# EAGLE design Airhockeypuck (EAGLE 9.5.1)
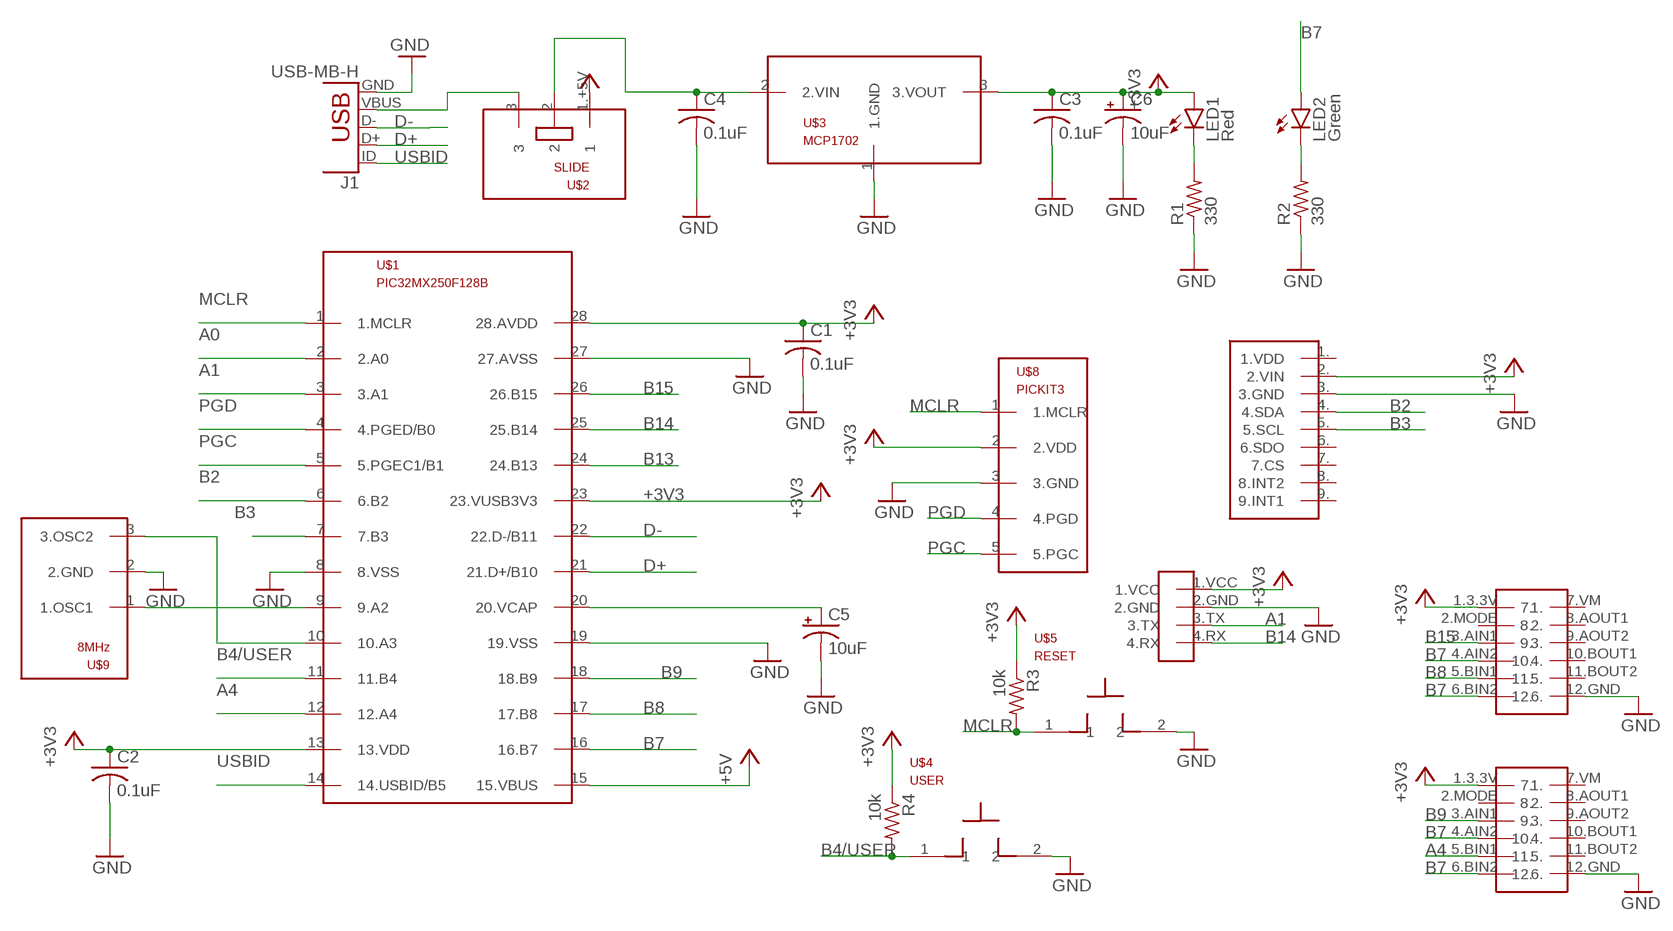
[diagram p0: schematic, sheet 1]

## Parts
C1  0.1uF  C-US025-025X050  [C025-025X050]
C2  0.1uF  C-US025-025X050  [C025-025X050]
C3  0.1uF  C-US025-025X050  [C025-025X050]
C4  0.1uF  C-US025-025X050  [C025-025X050]
C5  10uF  CPOL-USB45181B  [B45181B]
C6  10uF  CPOL-USB45181B  [B45181B]
J1  USB-MB-H  [USB-MB-H]
LED1  Red  LED3MM  [LED3MM]
LED2  Green  LED3MM  [LED3MM]
R1  330  R-US_0207/10  [0207/10]
R2  330  R-US_0207/10  [0207/10]
R3  10k  R-US_0207/10  [0207/10]
R4  10k  R-US_0207/10  [0207/10]
U$1  PIC32MX250F128B  [DIL28-3]
U$2  SLIDE  [SLIDE]
U$3  MCP1702  [TO92]
U$4  USER  PB  [PB]
U$5  RESET  PB  [PB]
U$6  DRV8835  [DRV8835]
U$7  DRV8835  [DRV8835]
U$8  PICKIT3  [1X05]
U$9  8MHz  OSC  [OSC]
U$10  IMU  [IMU]
U$11  HC-08  [HC-08]

## Nets
+3V3: C1.1 C2.1 C3.1 C6.+ LED1.A R3.1 R4.1 U$1.13(13.VDD) U$1.23(23.VUSB3V3) U$1.28(28.AVDD) U$3.3(3.VOUT) U$6.1.3.3V(1.) U$7.1.3.3V(1.) U$8.2(2.VDD) U$10.2.(2.VIN)
+5V: U$1.15(15.VBUS) U$2.1.+5V
A0: U$1.2(2.A0)
A1: U$1.3(3.A1) U$11.3.TX
A4: U$1.12(12.A4) U$7.5.BIN1(5.)
B2: U$1.6(6.B2) U$10.4.(4.SDA)
B3: U$1.7(7.B3) U$10.5.(5.SCL)
B4/USER: R4.2 U$1.11(11.B4) U$4.1
B7: LED2.A U$1.16(16.B7) U$6.4.AIN2(4.) U$6.6.BIN2(6.) U$7.4.AIN2(4.) U$7.6.BIN2(6.)
B8: U$1.17(17.B8) U$6.5.BIN1(5.)
B9: U$1.18(18.B9) U$7.3.AIN1(3.)
B13: U$1.24(24.B13)
B14: U$1.25(25.B14) U$11.4.RX
B15: U$1.26(26.B15) U$6.3.AIN1(3.)
D+: J1.D+ U$1.21(21.D+/B10)
D-: J1.D- U$1.22(22.D-/B11)
GND: C1.2 C2.2 C3.2 C4.2 C5.- C6.- J1.GND R1.1 R2.1 U$1.8(8.VSS) U$1.19(19.VSS) U$1.27(27.AVSS) U$3.1(1.GND) U$4.2 U$5.2 U$6.12.GND(12.) U$7.12.GND(12.) U$8.3(3.GND) U$9.2(2.GND) U$10.3.(3.GND) U$11.2.GND
MCLR: R3.2 U$1.1(1.MCLR) U$5.1 U$8.1(1.MCLR)
N$1: J1.VBUS U$2.3
N$2: U$1.9(9.A2) U$9.1(1.OSC1)
N$3: U$11.1.VCC ; supply symbol labelled +3V3
N$4: LED2.K(C) R2.2
N$5: LED1.K(C) R1.2
N$6: U$1.10(10.A3) U$9.3(3.OSC2)
N$7: C5.+ U$1.20(20.VCAP)
N$8: C4.1 U$2.2 U$3.2(2.VIN)
PGC: U$1.5(5.PGEC1/B1) U$8.5(5.PGC)
PGD: U$1.4(4.PGED/B0) U$8.4(4.PGD)
USBID: J1.ID U$1.14(14.USBID/B5)
Unconnected: U$6.2.MODE(2.) U$6.7.VM(7.) U$6.8.AOUT1(8.) U$6.9.AOUT2(9.) U$6.10.BOUT1(10.) U$6.11.BOUT2(11.) U$7.2.MODE(2.) U$7.7.VM(7.) U$7.8.AOUT1(8.) U$7.9.AOUT2(9.) U$7.10.BOUT1(10.) U$7.11.BOUT2(11.) U$10.1.(1.VDD) U$10.6.(6.SDO) U$10.7.(7.CS) U$10.8.(8.INT2) U$10.9.(9.INT1)

## Library data of the parts
C1-C4 = MEE_433:C-US: CAPACITOR, American symbol; SPICEPREFIX: C
C5 C6 = MEE_433:CPOL-US: POLARIZED CAPACITOR, American symbol; SPICEPREFIX: C
J1 = MEE_433:USB: USB Connectors USB-B-PTH is fully proven SKU : PRT-00139/CONN-08278 USB-miniB is fully proven SKU : PRT-00587 USB-A-PCB is untested. USB-A-H is throughly reviewed, but untested. Spark Fun Electronics SKU : PRT-00437 USB-B-SMT is throughly reviewed, but untested. Needs silkscreen touching up. USB-A-S has not been used/tested USB-MB-H has not been used/tested USB-MICROB has been used. CONN-09505
LED1 LED2 = led:LED: LED OSRAM: - CHIPLED LG R971, LG N971, LY N971, LG Q971, LY Q971, LO R971, LY R971 LH N974, LH R974 LS Q976, LO Q976, LY Q976 LO Q996 - Hyper CHIPLED LW Q18S LB Q993, LB Q99A, LB R99A - SideLED LS A670, LO A670, LY A670, LG A670, LP A670 LB A673, LV A673, LT A673, LW A673 LH A674 LY A675 LS A676, LA A676, LO A676, LY A676, LW A676 LS A679, LY A679, LG A679 - Hyper Micro SIDELED® LS Y876, LA Y876, LO Y876, LY Y876 LT Y87S - SmartLED LW L88C, LW L88S LB L89C, LB L89S, LG L890 LS L89K, LO L89K, LY L89K LS L896, LA L896, LO L896, LY L896 - TOPLED LS T670, LO T670, LY T670, LG T670, LP T670 LSG T670, LSP T670, LSY T670, LOP T670, LYG T670 LG T671, LOG T671, LSG T671 LB T673, LV T673, LT T673, LW T673 LH T674 LS T676, LA T676, LO T676, LY T676, LB T676, LH T676, LSB T676, LW T676 LB T67C, LV T67C, LT T67C, LS T67K, LO T67K, LY T67K, LW E67C LS E67B, LA E67B, LO E67B, LY E67B, LB E67C, LV E67C, LT E67C LW T67C LS T679, LY T679, LG T679 LS T770, LO T770, LY T770, LG T770, LP T770 LB T773, LV T773, LT T773, LW T773 LH T774 LS E675, LA E675, LY E675, LS T675 LS T776, LA T776, LO T776, LY T776, LB T776 LHGB T686 LT T68C, LB T68C - Hyper Mini TOPLED® LB M676 - Mini TOPLED Santana® LG M470 LS M47K, LO M47K, LY M47K Source: http://www.osram.convergy.de LUXEON: - LUMILED® LXK2-PW12-R00, LXK2-PW12-S00, LXK2-PW14-U00, LXK2-PW14-V00 LXK2-PM12-R00, LXK2-PM12-S00, LXK2-PM14-U00 LXK2-PE12-Q00, LXK2-PE12-R00, LXK2-PE12-S00, LXK2-PE14-T00, LXK2-PE14-U00 LXK2-PB12-K00, LXK2-PB12-L00, LXK2-PB12-M00, LXK2-PB14-N00, LXK2-PB14-P00, LXK2-PB14-Q00 LXK2-PR12-L00, LXK2-PR12-M00, LXK2-PR14-Q00, LXK2-PR14-R00 LXK2-PD12-Q00, LXK2-PD12-R00, LXK2-PD12-S00 LXK2-PH12-R00, LXK2-PH12-S00 LXK2-PL12-P00, LXK2-PL12-Q00, LXK2-PL12-R00 Source: www.luxeon.com KINGBRIGHT: KA-3528ASYC Source: www.kingbright.com
R1-R4 = MEE_433:R-US_: RESISTOR, American symbol; SPICEPREFIX: R
U$1 = MEE_433:PIC32MX250F128B
U$2 = MEE_433:SLIDE
U$3 = MEE_433:MCP1702
U$4 U$5 = MEE_433:PB
U$6 U$7 = MEE_433:DRV8835
U$8 = MEE_433:PICKIT3
U$9 = MEE_433:OSC
U$10 = MEE_433:IMU
U$11 = MEE_433:HC-08

## Board
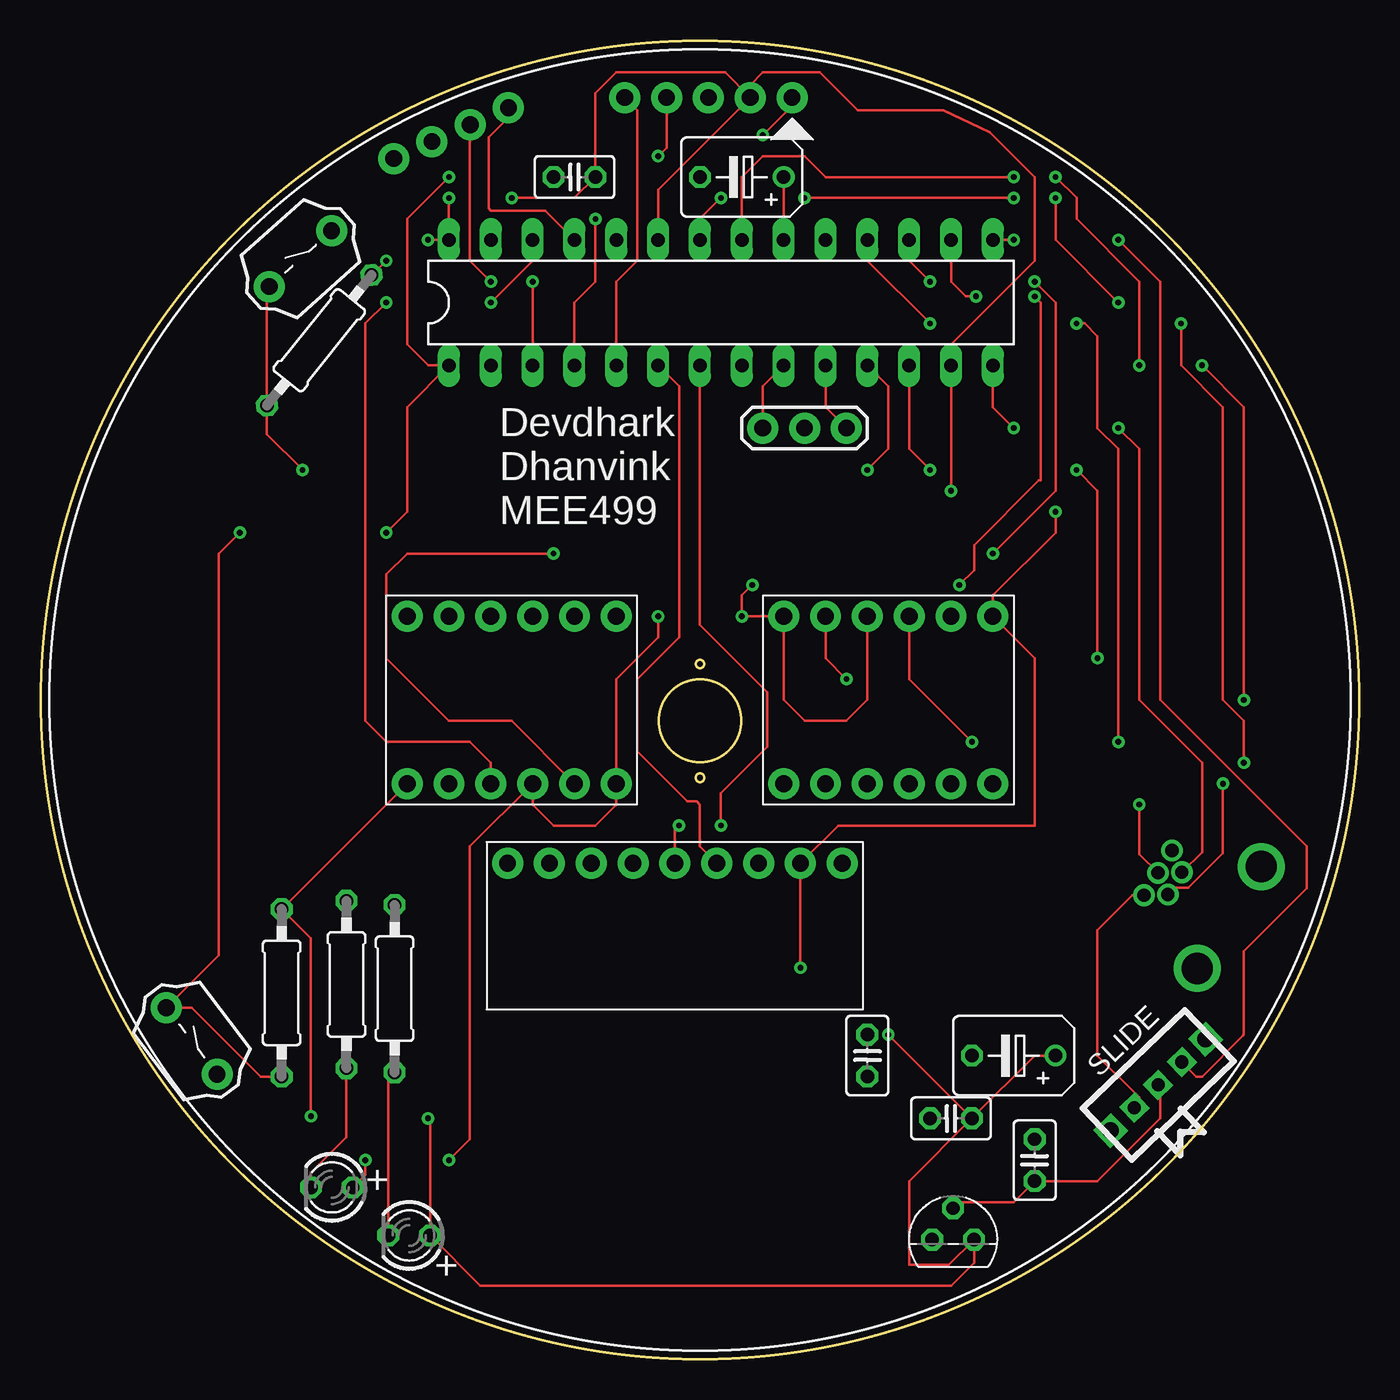
[diagram p1: board, top side]
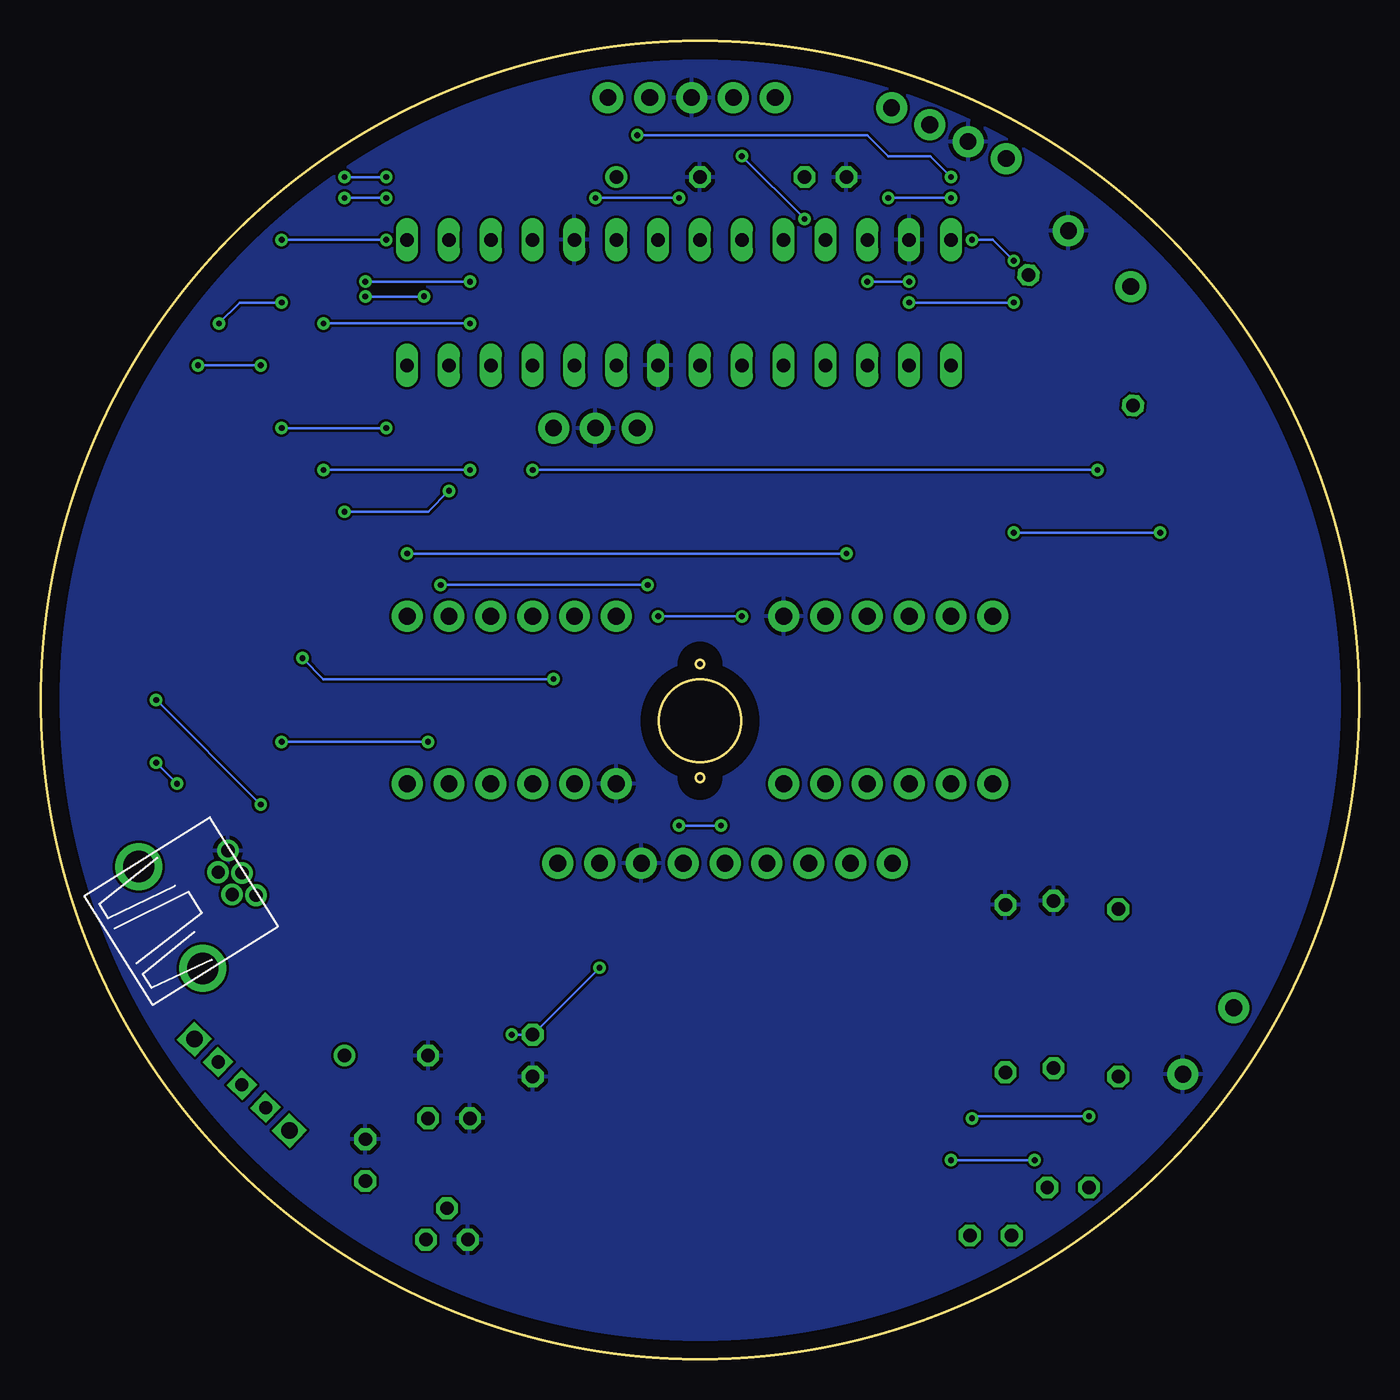
[diagram p2: board, bottom side, seen from below]

Size 80 x 80 mm. Coordinates in mm from the lower left corner, seen from the top.
Outline: circle at 40,40 radius 40
Outline: circle at 40,38.73 radius 2.5
Outline: circle at 40,42.18 radius 0.25
Outline: circle at 40,35.28 radius 0.25
Copper layers (1*16): Top 0.035mm / dielectric 1.5mm / Bottom 0.035mm
Design rules "default": minimum track width 6mil, minimum drill 0.35mm, track to track 6mil, track to pad 6mil, pad to pad 6mil, via to via 6mil, smd to smd 6mil, copper to edge 40mil, drill to drill 6mil, minimum pad ring 10mil, minimum via ring 8mil, stop-mask expansion 4mil, vias tented up to drill 0mil, thermal gap 10mil

### Footprints (pad centres in the part's own frame; a part is rotated, then mirrored left to right if it is on the bottom)
C025-025X050 = drill 0.813 octagon: 1 -1.27,0; 2 1.27,0
B45181B = drill 0.813: + -2.54,0 | drill 0.813 octagon: - 2.54,0
USB-MB-H = drill 0.8: D+ 5.1,0; D- 3.9,0.8; GND 5.1,-1.6; ID 3.9,-0.8; VBUS 5.1,1.6 | drill 1.9: P$6 0,-3.65; P$7 0,3.65
LED3MM = drill 0.813 octagon: A -1.27,0; K 1.27,0
0207/10 = drill 0.813 octagon: 1 -5.08,0; 2 5.08,0
DIL28-3 = drill 0.813 long: 1 -16.51,-3.81; 2 -13.97,-3.81; 3 -11.43,-3.81; 4 -8.89,-3.81; 5 -6.35,-3.81; 6 -3.81,-3.81; 7 -1.27,-3.81; 8 1.27,-3.81; 9 3.81,-3.81; 10 6.35,-3.81; 11 8.89,-3.81; 12 11.43,-3.81; 13 13.97,-3.81; 14 16.51,-3.81; 15 16.51,3.81; 16 13.97,3.81; 17 11.43,3.81; 18 8.89,3.81; 19 6.35,3.81; 20 3.81,3.81; 21 1.27,3.81; 22 -1.27,3.81; 23 -3.81,3.81; 24 -6.35,3.81; 25 -8.89,3.81; 26 -11.43,3.81; 27 -13.97,3.81; 28 -16.51,3.81
SLIDE = drill 0.8 square: 1.+5V -2,0; 2 0,0; 3 2,0 | drill 1 square: P$1 -4,0; P$2 4,0
TO92 = drill 0.813 octagon: 1 -1.27,0; 2 0,1.905; 3 1.27,0
PB = drill 1.016 pad 1.88: 1 -2.54,0; 2 2.54,0
DRV8835 = drill 1.016 pad 1.88: 1.3.3V -5.08,5.08; 2.MODE -5.08,2.54; 3.AIN1 -5.08,0; 4.AIN2 -5.08,-2.54; 5.BIN1 -5.08,-5.08; 6.BIN2 -5.08,-7.62; 7.VM 5.08,5.08; 8.AOUT1 5.08,2.54; 9.AOUT2 5.08,0; 10.BOUT1 5.08,-2.54; 11.BOUT2 5.08,-5.08; 12.GND 5.08,-7.62
1X05 = drill 1.016 pad 1.88: 1 0,0; 2 2.54,0; 3 5.08,0; 4 7.62,0; 5 10.16,0
OSC = drill 1.016 pad 1.88: 1 -2.54,0; 2 0,0; 3 2.54,0
IMU = drill 1.016 pad 1.88: 1. 0,0; 2. 2.54,0; 3. 5.08,0; 4. 7.62,0; 5. 10.16,0; 6. 12.7,0; 7. 15.24,0; 8. 17.78,0; 9. 20.32,0
HC-08 = drill 1.016 pad 1.88: 1.VCC 0,3.81; 2.GND 0,1.27; 3.TX 0,-1.27; 4.RX 0,-3.81

### Placement (x,y rotation side)
C1  55.24,14.6 180 top
C2  50.16,18.41 270 top
C3  32.38,71.75 180 top
C4  60.32,12.06 90 top
C5  42.54,71.75 180 top
C6  59.05,18.41 180 top
J1  72.13,26.79 147.9 top
LED1  22.35,7.49 180 top
LED2  17.65,10.41 180 top
R1  21.46,22.47 270 top
R2  18.54,22.73 270 top
R3  14.6,22.22 270 top
R4  16.89,61.84 231.3 top
U$1  41.27,64.13 0 top
U$2  67.81,16.63 223.9 top
U$3  55.37,7.23 0 top
U$4  15.74,66.8 41.9 top
U$5  9.14,19.3 307.3 top
U$6  27.3,40 90 top
U$7  52.7,40 270 top
U$8  45.59,76.58 180 top
U$9  46.35,56.51 0 top
U$10  48.64,30.09 180 top
U$11  24.89,74.42 113.9 top

### Tracks (layer width: path | path; a pad name or v marks a point on that pad's centre or on a via)
+3V3  (via drill 0.35)
  Top 0.152: C1.1 52.7,10.79 52.7,5.71 55.11,5.71 U$3.3 56.64,5.84 55.24,4.44 26.66,4.44 LED1.A 23.62,14.47 v23.49,14.6 | C1.1 v51.43,19.68 | v46.1,23.74 U$10.2. 48.38,32.38 60.32,32.38 60.32,42.54 U$7.1.3.3V 57.78,46.35 61.59,50.16 v61.59,51.43 | v55.24,52.7 U$1.13 55.24,61.59 60.32,66.67 60.32,71.75 57.59,74.48 54.76,75.8 49.57,75.8 47.27,78.1 43.81,78.1 43.05,77.34 U$8.2 | U$8.2 37.46,70.99 U$1.23 | U$8.2 41.52,78.1 34.92,78.1 33.65,76.83 C3.1 32.38,70.48 v28.57,70.48 | v16.38,14.73 16.38,25.52 R3.1 U$6.1.3.3V | C1.1 60.32,18.41 C6.+ | R4.1 20.09,65.81 v20.95,66.67 | v23.49,67.94 U$1.28 v24.76,70.48
  Bottom 0.152: v51.43,19.68 C2.1 v46.1,23.74 | v16.38,14.73 23.36,14.73 v23.49,14.6 | v61.59,51.43 56.51,51.43 v55.24,52.7 | v20.95,66.67 22.22,67.94 v23.49,67.94 | v28.57,70.48 v24.76,70.48
+5V  (via drill 0.35)
  Top 0.152: U$2.1.+5V 70.13,17.14 70.48,17.14 72.94,19.6 73.02,19.71 73.02,24.76 76.83,28.57 76.83,31.11 67.94,40 67.94,65.4 v65.4,67.94 | v59.05,67.94 U$1.15
  Bottom 0.152: v65.4,67.94 v59.05,67.94
A1  (via drill 0.35)
  Top 0.152: U$11.3.TX 26.03,74.91 26.03,66.67 v27.3,65.4 | U$1.3 v29.84,65.4
  Bottom 0.152: v29.84,65.4 v27.3,65.4
A4  (via drill 0.35)
  Top 0.152: v64.13,42.54 64.13,52.7 v62.86,53.97 | v53.97,53.97 52.7,55.24 U$1.12 | v48.89,41.27 47.62,42.54 U$7.5.BIN1
  Bottom 0.152: v64.13,42.54 62.86,41.27 v48.89,41.27 | v62.86,53.97 v53.97,53.97
B2
  Top 0.152: U$10.4. 40,31.11 40,33.65 39.79,33.86 39.22,33.86 36.19,36.89 36.19,41.27 38.73,43.81 38.73,59.05 U$1.6
B3  (via drill 0.35)
  Top 0.152: U$10.5. 38.48,32.13 v38.73,32.38 | v41.27,32.38 41.27,34.35 44.09,37.18 44.09,40.48 40,44.57 U$1.7
  Bottom 0.152: v38.73,32.38 v41.27,32.38
B4/USER  (via drill 0.35)
  Top 0.152: v15.87,53.97 13.71,56.13 R4.2 13.71,64.96 U$4.1 | v50.16,53.97 51.43,55.24 51.43,59.05 U$1.11
  Bottom 0.152: v15.87,53.97 v50.16,53.97
B7  (via drill 0.35)
  Top 0.152: v43.17,46.98 42.54,46.35 v42.54,45.08 U$7.6.BIN2 45.08,40 46.35,38.73 48.89,38.73 50.16,40 U$7.4.AIN2 | v55.75,46.98 56.64,47.87 56.64,49.4 60.57,53.33 60.7,53.33 60.7,64.13 60.34,64.49 v60.32,64.49 | U$1.16 55.24,65.4 56.13,64.51 v56.76,64.51 | LED2.A 19.68,11.17 v19.68,12.06 | v24.76,12.06 26.03,13.33 26.03,31.11 U$6.4.AIN2 29.84,33.65 31.11,32.38 33.65,32.38 34.92,33.65 U$6.6.BIN2 34.92,41.27 37.46,43.81 v37.46,45.08
  Bottom 0.152: v42.54,45.08 v37.46,45.08 | v43.17,46.98 v55.75,46.98 | v60.32,64.49 56.78,64.49 v56.76,64.51 | v19.68,12.06 v24.76,12.06
B8  (via drill 0.35)
  Top 0.152: v57.78,48.89 61.59,52.7 61.59,64.13 v60.32,65.4 | v53.97,65.4 52.7,66.67 U$1.17 | v31.11,48.89 22.22,48.89 20.95,47.62 20.95,42.54 24.76,38.73 28.57,38.73 U$6.5.BIN1
  Bottom 0.152: v31.11,48.89 v57.78,48.89 | v60.32,65.4 v53.97,65.4
B9  (via drill 0.35)
  Top 0.152: v65.4,37.46 65.4,55.24 64.13,56.51 64.13,62.1 63.37,62.86 v62.86,62.86 | v53.97,62.86 50.16,66.67 U$1.18 | v56.51,37.46 52.7,41.27 U$7.3.AIN1
  Bottom 0.152: v56.51,37.46 v65.4,37.46 | v62.86,62.86 v53.97,62.86
B14
  Top 0.152: U$1.25 30.6,69.72 27.3,69.72 27.17,69.84 27.17,74.16 28.37,75.36 U$11.4.RX
B15  (via drill 0.35)
  Top 0.152: v20.95,64.13 19.68,62.86 19.68,38.73 20.95,37.46 26.03,37.46 27.3,36.19 U$6.3.AIN1 | v27.3,64.13 29.84,66.67 U$1.26
  Bottom 0.152: v27.3,64.13 v20.95,64.13
D+  (via drill 0.35)
  Top 0.152: J1.D+ 66.67,30.64 v66.67,33.65 | v73.02,40 73.02,57.78 v70.48,60.32 | v59.05,71.75 47.62,71.75 46.35,73.02 43.81,73.02 42.54,71.75 U$1.21 | v66.67,60.32 66.67,65.4 62.86,69.21 62.86,70.48 v61.59,71.75
  Bottom 0.152: v66.67,33.65 v73.02,40 | v70.48,60.32 v66.67,60.32 | v61.59,71.75 v59.05,71.75
D-  (via drill 0.35)
  Top 0.152: J1.D- 68.82,28.6 69.64,28.6 71.75,30.71 v71.75,34.92 | v69.21,62.86 69.21,60.32 71.75,57.78 71.75,40 73.02,38.73 v73.02,36.19 | v65.4,64.13 61.59,67.94 v61.59,70.48 | v41.27,70.48 40,69.21 U$1.22 | v59.05,70.48 v46.35,70.48
  Bottom 0.152: v71.75,34.92 v73.02,36.19 | v69.21,62.86 67.94,64.13 v65.4,64.13 | v61.59,70.48 v59.05,70.48 | v46.35,70.48 v41.27,70.48
GND
  pour Bottom (isolate 0.012): 40,79.37 arc90 0.63,40 arc90 40,0.63 arc90 79.37,40 arc90
MCLR  (via drill 0.35)
  Top 0.152: R3.2 13.33,17.14 9.15,21.32 U$5.1 10.79,24.51 10.79,48.89 v12.06,50.16 | v20.95,50.16 22.22,51.43 22.22,57.78 U$1.1 23.49,60.32 22.22,61.59 22.22,69.21 v24.76,71.75 | v43.81,74.29 45.59,76.07 U$8.1
  Bottom 0.152: v12.06,50.16 v20.95,50.16 | v24.76,71.75 26.03,73.02 28.57,73.02 29.84,74.29 v43.81,74.29
N$1
  Top 0.152: J1.VBUS 66.25,28.15 64.13,26.03 64.13,18.41 66.67,15.87 66.67,15.54 U$2.3
N$2
  Top 0.152: U$9.1 43.81,59.05 U$1.9
N$4
  Top 0.152: LED2.K 16.38,11.3 18.54,13.46 R2.2
N$5
  Top 0.152: LED1.K 21.08,17.01 R1.2
N$6
  Top 0.152: U$9.3 47.62,57.78 U$1.10
N$7
  Top 0.152: U$1.20 C5.+
N$8
  Top 0.152: U$3.2 55.75,9.52 59.05,9.52 C4.1 64.13,10.79 67.94,14.6 67.94,16.5 U$2.2
PGC
  Top 0.152: U$1.5 34.92,65.4 36.19,66.67 36.19,75.81 U$8.5
PGD  (via drill 0.35)
  Top 0.152: U$1.4 32.38,64.13 33.65,65.4 v33.65,69.21 | U$8.4 37.97,73.53 v37.46,73.02
  Bottom 0.152: v33.65,69.21 v37.46,73.02
USBID  (via drill 0.35)
  Top 0.152: v65.4,56.51 66.67,55.24 66.67,40 70.48,36.19 70.48,31.11 70.48,30.77 J1.ID | v59.05,56.51 57.78,57.78 U$1.14
  Bottom 0.152: v65.4,56.51 v59.05,56.51

### Text on the board
tPlace: Devdhark / Dhanvink / MEE499 | + | +